# EasyEDA Pro project UCC隔离半桥.eprj

# Schematic Schematic1
Board Name: Board1; Create Date: 2026-04-12; Page Name: P1; Project Name: UCC隔离半桥; Schematic Name: Schematic1; Update Date: 2026-04-18; Company: 嘉立创EDA; Page Size: A4; Version: V1.0
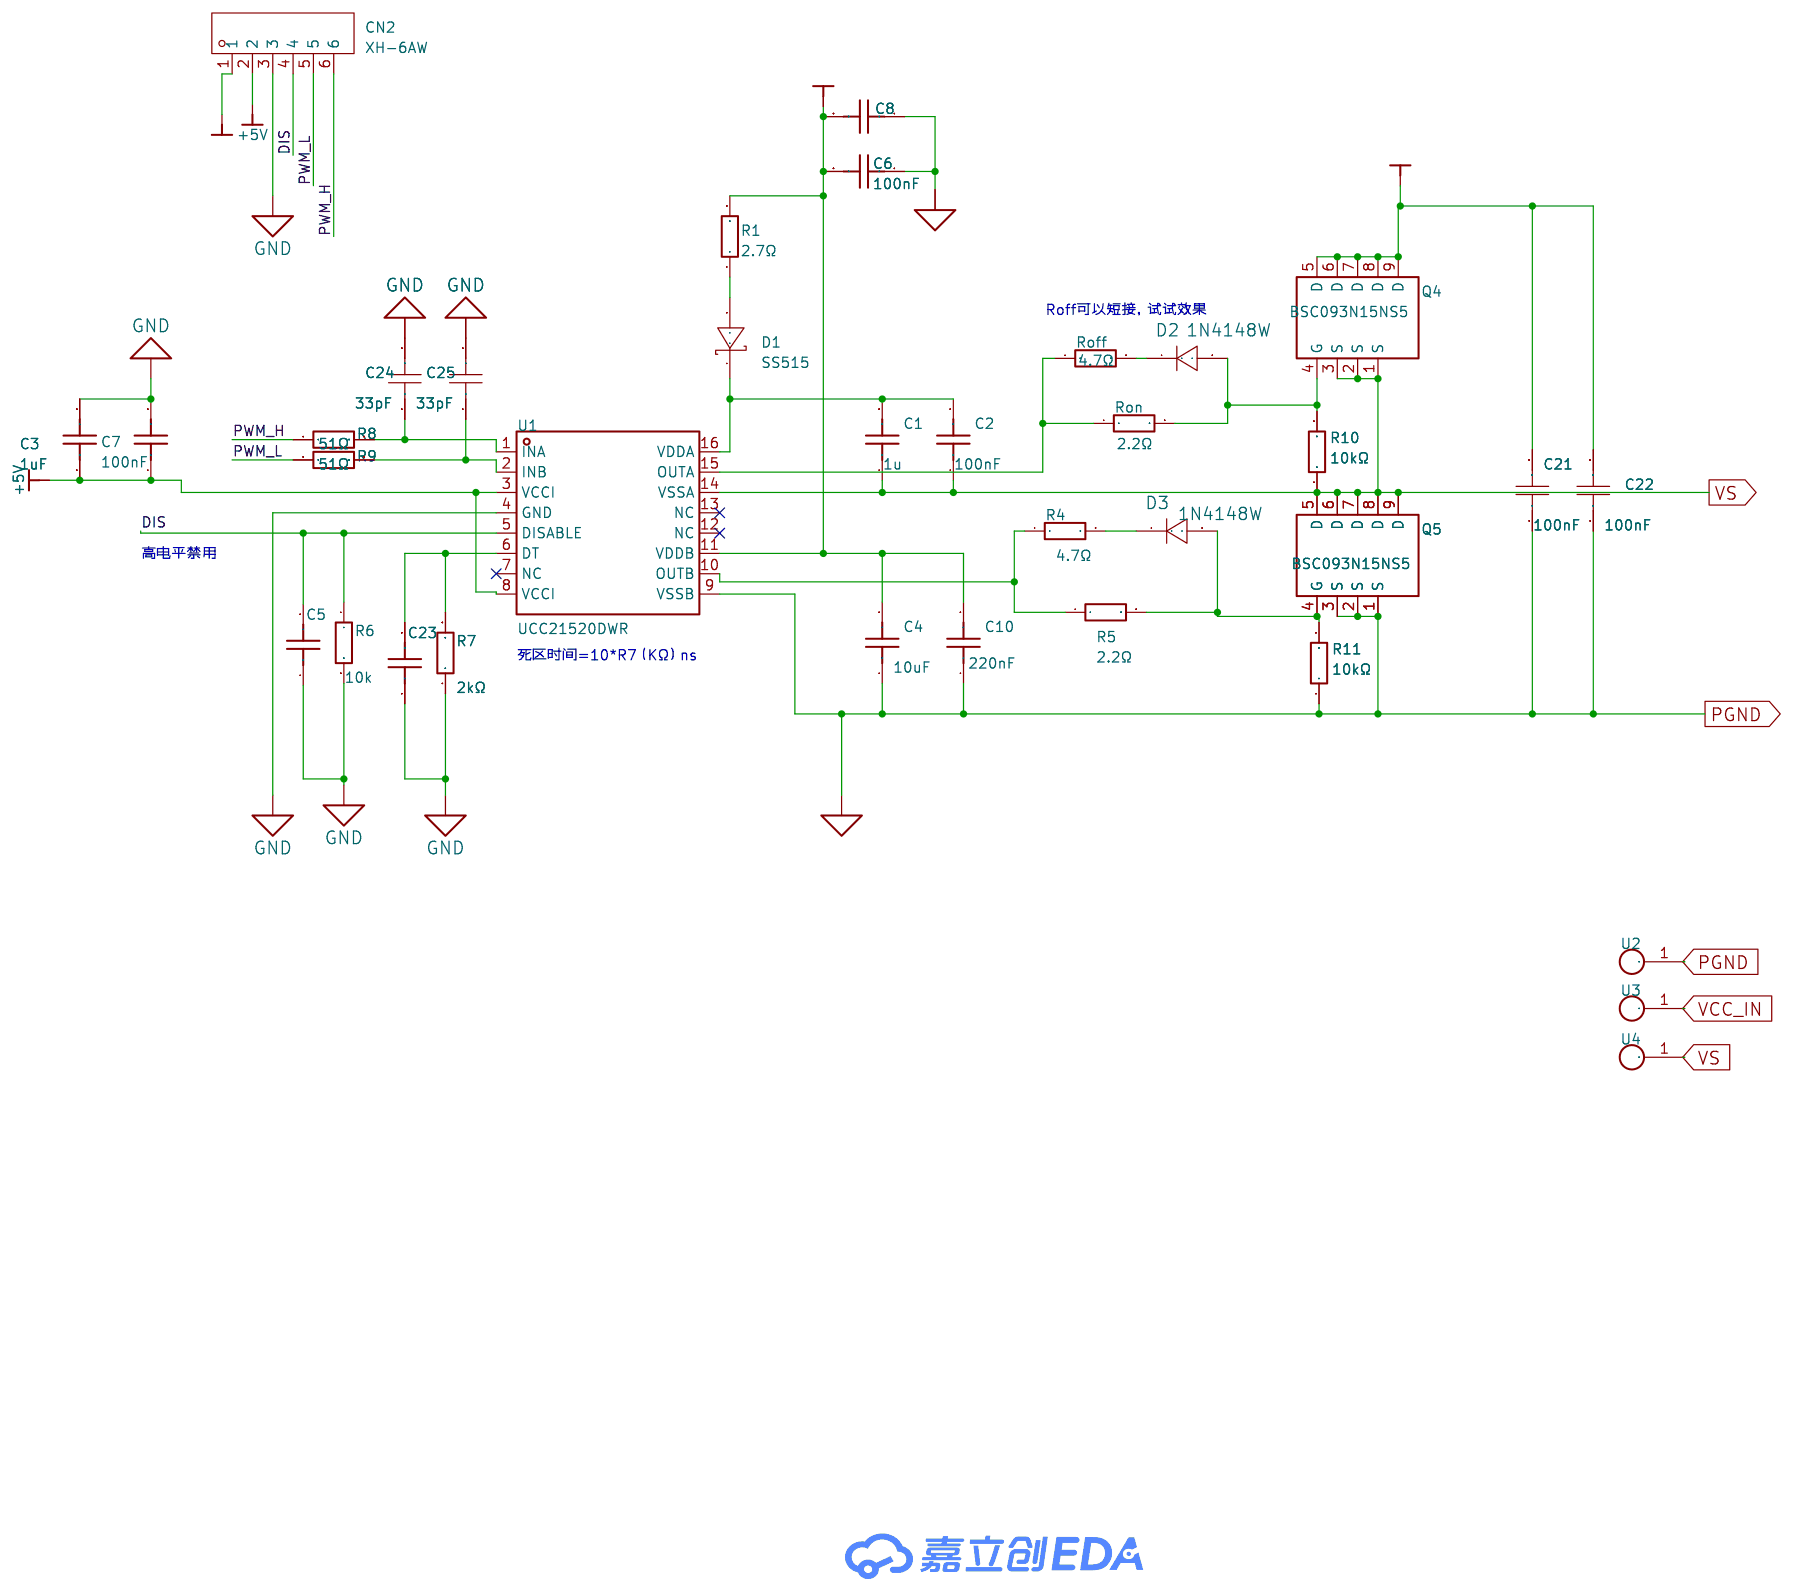
[diagram p0: schematic sheet]

## Parts
C1  1u  [C0603]
C2  100nF  [C0603]
C3  1uF  [C0603]
C4  10uF  [C0603]
C5  1nF  [C0603]
C6  100nF  [C0603]
C7  100nF  [C0603]
C8  10uF  [C0603]
C10  220nF  [C0603]
C21  100nF  [C1206]
C22  100nF  [C1206]
C23  1nF  [C0603]
C24  33pF  [C0603]
C25  33pF  [C0603]
CN2  XH-6AW  [CONN-TH_6P-P2.54_HCTL_XH-6AW_C2908615]
D1  SS515  [SMA_L4.3-W2.6-LS5.2-RD]
D2  1N4148W  [SOD-123_L2.8-W1.8-LS3.7-RD]
D3  1N4148W  [SOD-123_L2.8-W1.8-LS3.7-RD]
Q4  BSC093N15NS5  [PG-TDSON-8_L5.0-W6.0-P1.27-LS6.2-BL-EP]
Q5  BSC093N15NS5  [PG-TDSON-8_L5.0-W6.0-P1.27-LS6.2-BL-EP]
R1  2.7Ω  [R0603]
R4  4.7Ω  [R0603]
R5  2.2Ω  [R0603]
R6  10k  [R0603]
R7  2kΩ  [R0603]
R8  51Ω  [R0603]
R9  51Ω  [R0603]
R10  10kΩ  [R0603]
R11  10kΩ  [R0603]
Roff  4.7Ω  [R0603]
Ron  2.2Ω  [R0603]
U1  UCC21520DWR  [SOIC-16_L10.3-W7.5-P1.27-LS10.3-BL]
U2  -  [3.5mm香蕉头]
U3  -  [3.5mm香蕉头]
U4  -  [3.5mm香蕉头]

## Library data of the parts
C1 C2 = CAP_0805: Supplier Footprint: 0805; Check: false
C3 C10 = CC0603KRX7R9BB104: LCSC Part Name: 100nF ±10% 50V; Supplier Part: C14663; Manufacturer: YAGEO(国巨); Supplier Footprint: 0603; JLCPCB Part Class: Basic Part; Datasheet: https://item.szlcsc.com/datasheet/CC0603KRX7R9BB104/15331.html; Supplier: LCSC; Tolerance: ±10%; Voltage Rating: 50V; Temperature Coefficient: X7R
C4 C7 = CL10A105KB8NNNC: LCSC Part Name: 1uF ±10% 50V; Supplier Part: C15849; Manufacturer: SAMSUNG(三星); Supplier Footprint: 0603; JLCPCB Part Class: Basic Part; Datasheet: https://item.szlcsc.com/datasheet/CL10A105KB8NNNC/16531.html; Supplier: LCSC; Tolerance: ±10%; Voltage Rating: 50V; Temperature Coefficient: X5R
C5 C23 = CL10B102KB8NNNC: LCSC Part Name: 1nF ±10% 50V; Supplier Part: C1588; Manufacturer: SAMSUNG(三星); Supplier Footprint: 0603; JLCPCB Part Class: Basic Part; Datasheet: https://item.szlcsc.com/datasheet/CL10B102KB8NNNC/1940.html; Supplier: LCSC; Tolerance: ±10%; Voltage Rating: 50V; Temperature Coefficient: X7R
C6 = CL10A105KB8NNNC: 容值:1uF;精度:±10%;额定电压:50V;温度系数:X5R;; LCSC Part Name: 1uF ±10% 50V; Supplier Part: C15849; Manufacturer: SAMSUNG(三星); Supplier Footprint: 0603; JLCPCB Part Class: Basic Part; Datasheet: https://item.szlcsc.com/datasheet/CL10A105KB8NNNC/16531.html; Supplier: LCSC; Tolerance: ±10%; Voltage Rating: 50V; Temperature Coefficient: X5R
C8 = CL10A106KP8NNNC: 容值:10uF;精度:±10%;额定电压:10V;温度系数:X5R;; LCSC Part Name: 10uF ±10% 10V; Supplier Part: C19702; Manufacturer: SAMSUNG(三星); Supplier Footprint: 0603; JLCPCB Part Class: Basic Part; Datasheet: https://item.szlcsc.com/datasheet/CL10A106KP8NNNC/20411.html; Supplier: LCSC; Tolerance: ±10%; Voltage Rating: 10V; Temperature Coefficient: X5R
C21 C22 = AM06B475K500NT: 容值:4.7uF;精度:±10%;额定电压:50V;温度系数:X7R;; LCSC Part Name: 4.7uF ±10% 50V; Supplier Part: C47118771; Manufacturer: FH(风华); Supplier Footprint: 1206; JLCPCB Part Class: 扩展库; Datasheet: https://item.szlcsc.com/datasheet/AM06B475K500NT/49314161.html; Supplier: LCSC; Tolerance: ±10%; Voltage Rating: 50V; Temperature Coefficient: X7R
C24 C25 = CC0603JRNPO9BN330: 容值:33pF;精度:±5%;额定电压:50V;材质(温度系数):NP0;; LCSC Part Name: 33pF ±5% 50V; Supplier Part: C107047; Manufacturer: YAGEO(国巨); Supplier Footprint: 0603; JLCPCB Part Class: Extended Part; Datasheet: https://atta.szlcsc.com/upload/public/pdf/source/20170914/C128857_1505359892143968080.pdf; Supplier: LCSC; Tolerance: ±5%; Voltage Rated: 50V; Temperature Coefficient: NP0
CN2 = XH-6AW: 插针结构:1x6P;间距:2.5mm;安装方式:弯插;参考系列:XH;总PIN数:6P;排数:1;每排PIN数:6;行距:-;额定电流:3A;触头材质:黄铜;触头镀层:锡;工作温度:-25℃~+85℃;; LCSC Part Name: 1x6P 间距:2.5mm 弯插 系列:XH; Supplier Part: C2908615; Manufacturer: HCTL(华灿天禄); Supplier Footprint: 弯插,P=2.5mm; JLCPCB Part Class: 扩展库; Datasheet: https://item.szlcsc.com/datasheet/XH-6AW/3184386.html; Supplier: LCSC; Pins Structure: 1x6P; Pitch: 2.5mm; Mounting Type: 弯插; Reference Series: XH; Number of Pins: 6P; Number of Rows: 1; Number of PINs Per Row: 6; Current Rating: 3A; Contact Material: 黄铜; Contact Plating: 锡; Operating Temperature: -25℃~+85℃; Voltage Rating: 250V; Plastic Material: PA66; Flame Retardant Rating: UL94V-0; Z-Height of the Board: 5.9mm; Y-Width of Bottom Edge on Board: 7mm
D1 = SS510_C65010: 100V,5A,VF=0.85V@5A; LCSC Part Name: SS510; Supplier Part: C65010; Manufacturer: MDD; Supplier Footprint: SMA(DO-214AC); JLCPCB Part Class: 扩展库; Datasheet: https://atta.szlcsc.com/upload/public/pdf/source/20190306/C65010_D958AD6D6141949533CEFECD76698368.pdf; Supplier: LCSC
D2 D3 = 1N4148W_C2099: 二极管配置:独立式;正向压降(Vf):1.25V@150mA;直流反向耐压(Vr):100V;平均整流电流(Io):150mA;反向恢复时间(trr):4ns;; LCSC Part Name: 电压:100V 电流:150mA; Supplier Part: C2099; Manufacturer: CJ(江苏长电/长晶); Supplier Footprint: SOD-123; JLCPCB Part Class: Extended Part; Datasheet: https://atta.szlcsc.com/upload/public/pdf/source/20120428/1457706480199.pdf; Supplier: LCSC; Diode Configuration: 独立式; Forward Voltage (Vf@If): 1.25V@150mA; Reverse Voltage (Vr): 100V; Average Rectified Current (Io): 150mA; Reverse Leakage Current: 1uA@75V; Reverse Recovery Time (trr): 4ns
Q4 Q5 = BSC093N15NS5: LCSC Part Name: 1个N沟道 耐压:150V 电流:87A; Supplier Part: C454270; Manufacturer: Infineon(英飞凌); Supplier Footprint: TDSON-8(5x6); JLCPCB Part Class: 扩展库; Datasheet: https://item.szlcsc.com/datasheet/BSC093N15NS5/456361.html; Supplier: LCSC; Number: 1个N沟道; Drain to Source Voltage: 150V; Current - Continuous Drain(Id): 87A; RDS(on): 9.3mΩ@10V,44A; Pd - Power Dissipation: 139W; Gate Threshold Voltage (Vgs(th)): 4.6V; Gate Charge(Qg): 40.7nC@10V; Input Capacitance(Ciss): 3.23nF@75V; Reverse Transfer Capacitance (Crss@Vds): 26pF@75V; Operating Temperature: -55℃~+150℃
R1 = RC0805FR-072R2L: LCSC Part Name: 厚膜电阻 2.2Ω ±1% 125mW; Supplier Part: C137549; Manufacturer: YAGEO(国巨); Supplier Footprint: 0805; JLCPCB Part Class: Extended Part; Datasheet: https://atta.szlcsc.com/upload/public/pdf/source/20180821/C275644_0D56F95EFF785E7D9A1FEF436B37DA78.pdf; Supplier: LCSC; Type: 厚膜电阻; Tolerance: ±1%; Power(Watts): 125mW; Overload Voltage (Max): 150V; Temperature Coefficient: ±200ppm/℃; Operating Temperature Range: -55℃~+155℃
R4 R5 Roff Ron = Res_1206: Supplier Footprint: 1206
R6 R7 = RC0603FR-0710KL: LCSC Part Name: 厚膜电阻 10kΩ ±1% 100mW; Supplier Part: C98220; Manufacturer: YAGEO(国巨); Supplier Footprint: 0603; JLCPCB Part Class: Extended Part; Datasheet: https://atta.szlcsc.com/upload/public/pdf/source/20180927/C295883_E8D83085EA81BD7DE0B2B681138C15EE.pdf; Supplier: LCSC; Type: 厚膜电阻; Tolerance: ±1%; Power(Watts): 100mW; Overload Voltage (Max): 75V; Temperature Coefficient: ±100ppm/℃; Operating Temperature Range: -55℃~+155℃
R8 R9 = 0603WAF510JT5E: LCSC Part Name: 51Ω ±1% 100mW 厚膜电阻; Supplier Part: C23197; Manufacturer: UNI-ROYAL(厚声); Supplier Footprint: 0603; JLCPCB Part Class: Basic Part; Datasheet: https://item.szlcsc.com/datasheet/0603WAF510JT5E/23924.html; Supplier: LCSC; Type: 厚膜电阻; Tolerance: ±1%; Power(Watts): 100mW; Voltage-Supply(Max): 75V; Temperature Coefficient: ±100ppm/℃; Operating Temperature: -55℃~+155℃
R10 R11 = 0603WAF1002T5E: LCSC Part Name: 厚膜电阻 10kΩ ±1% 100mW; Supplier Part: C25804; Manufacturer: UNI-ROYAL(厚声); Supplier Footprint: 0603; JLCPCB Part Class: Basic Part; Datasheet: https://item.szlcsc.com/datasheet/0603WAF1002T5E/26547.html; Supplier: LCSC; Type: 厚膜电阻; Tolerance: ±1%; Power(Watts): 100mW; Voltage-Supply(Max): 75V; Temperature Coefficient: ±100ppm/℃; Operating Temperature: -55℃~+155℃
U1 = UCC21520DWR: Supplier Part: C601651; Manufacturer: TI(德州仪器); Supplier Footprint: SOIC-16; JLCPCB Part Class: Extended Part; Supplier: LCSC; NO_CONNECT: yes
U2-U4 = 3.5mm香蕉头

## Nets
+5V: C3.1 C7.1 CN2.2 U1.3(VCCI) U1.8(VCCI)
+12V: C4.2 C6.2 C8.2 C10.2 CN2.1 R1.2 U1.11(VDDB)
GND: C3.2 C5.1 C7.2 C23.1 C24.2 C25.2 CN2.3 R6.2 R7.1 U1.4(GND)
PGND: C4.1 C6.1 C8.1 C10.1 C21.1 C22.1 Q5.1(S) Q5.2(S) Q5.3(S) R11.1 U1.9(VSSB) U2.1
VCC_IN: C21.2 C22.2 Q4.5(D) Q4.6(D) Q4.7(D) Q4.8(D) Q4.9(D) U3.1
DIS: C5.2 CN2.4 R6.1 U1.5(DISABLE)
PWM_H: CN2.6 R8.1
PWM_L: CN2.5 R9.1
VS: C1.1 C2.1 Q4.1(S) Q4.2(S) Q4.3(S) Q5.5(D) Q5.6(D) Q5.7(D) Q5.8(D) Q5.9(D) R10.1 U1.14(VSSA) U4.1
$1N1256: Roff.1 Ron.1 U1.15(OUTA)
$1N1258: C1.2 C2.2 D1.1(K) U1.16(VDDA)
$1N1260: D2.2(A) Q4.4(G) R10.2 Ron.2
$1N1264: D3.1(K) R4.2
$1N1267: C23.2 R7.2 U1.6(DT)
$1N1268: C24.1 R8.2 U1.1(INA)
$1N1269: C25.1 R9.2 U1.2(INB)
$1N2967: D1.2(A) R1.1
$1N3349: D2.1(K) Roff.2
$1N5239: D3.2(A) Q5.4(G) R5.2 R11.2
$1N5400: R4.1 R5.1 U1.10(OUTB)

Not connected (* = marked no-connect by the designer): U1 7(NC)* 12(NC)* 13(NC)*

## Notes on the sheet
- Roff可以短接，试试效果
- 高电平禁用
- 死区时间=10*R7（KΩ）ns

# Board PCB1
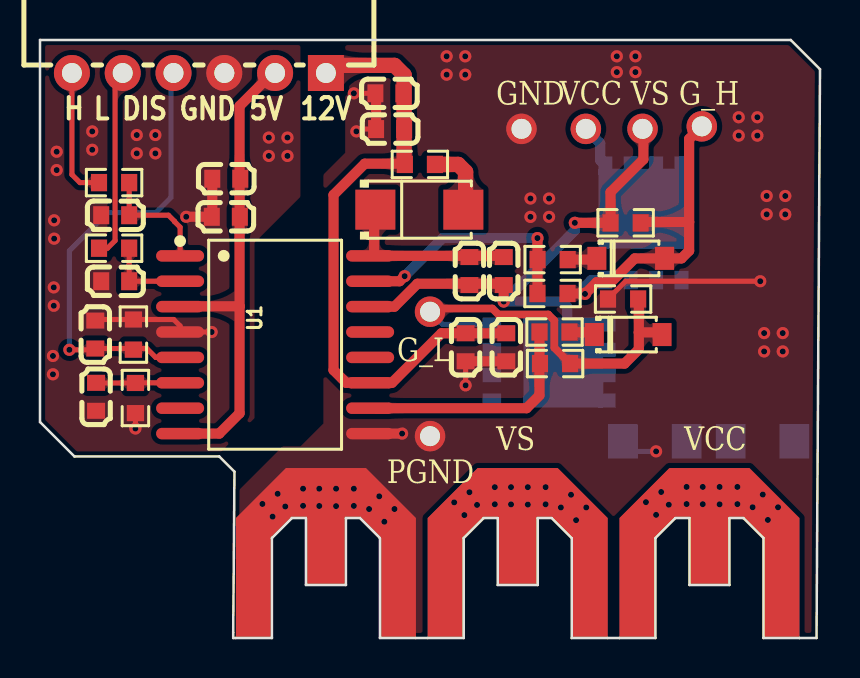
[diagram p1: board, top side]
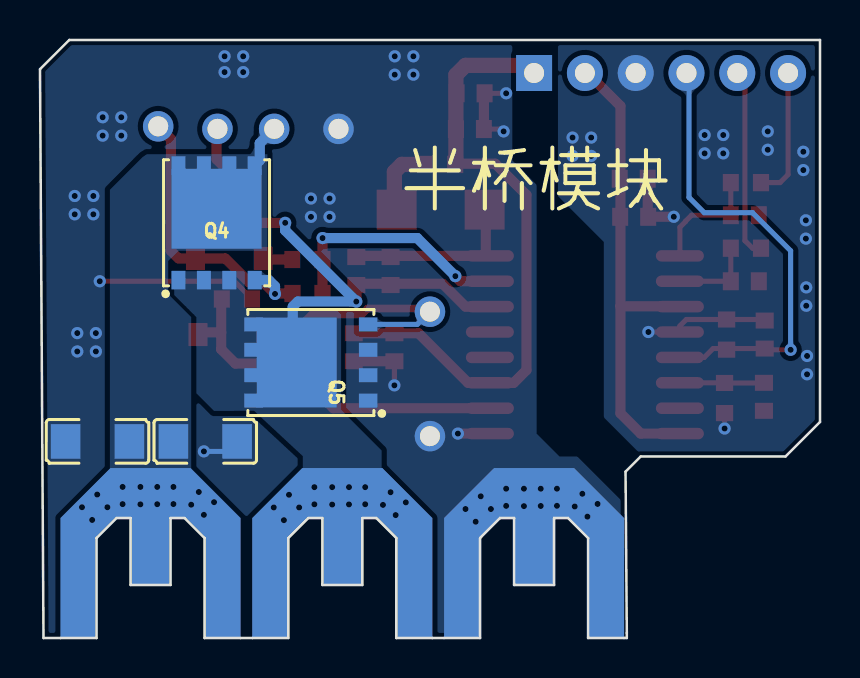
[diagram p2: board, bottom side, seen from below]

Outline 39 x 29.91 mm; copper layers: Top Layer, Bottom Layer. Coordinates in mm from the lower left corner of the outline.
Outline path: 9.8,0 9.66,0 9.66,0.26 9.72,8.32 8.96,9.08 1.72,9.08 0,10.8 0,29.91 37.54,29.91 39,28.44 38.83,0 37.97,0 ; 18.8,0 19.38,0 ; 28.38,0 28.97,0
Stack: Top Layer 0.035mm / Dielectric1 1.51mm FR4 er 4.5 / Bottom Layer 0.035mm

## Design rules (mm)
template: 自定义配置
spacing copperThickness1oz (default): track to track 0.102, other pairs 0.152 to 0.3
spacing copperThickness2oz: track to track 0.203, other pairs 0.152 to 0.3
track width copperThickness1oz (default): min 0.127, default 0.254, max 2.54
track width copperThickness2oz: min 0.203, default 0.254, max 2.54
differential pair differentialPair (default): width min 0.127, default 0.254, max 2.54; gap min 0.152, default 0.152
via viaSize (default): diameter min 0.5, default 0.61, max 10; hole min 0.3, default 0.305, max 6.3

## Placement (name value [footprint] x y rotation side)
C1  1u  [C0603]  21.47 18.35 90 top
C2  100nF  [C0603]  23.19 18.35 90 top
C3  1uF  [C0603]  9.29 21.07 180 top
C4  10uF  [C0603]  21.28 14.54 90 top
C5  1nF  [C0603]  2.77 15.18 270 top
C6  100nF  [C0603]  17.51 25.45 0 top
C7  100nF  [C0603]  9.31 22.97 180 top
C8  10uF  [C0603]  17.47 27.24 0 top
C10  220nF  [C0603]  23.31 14.54 90 top
C21  100nF  [C1206]  36.13 9.83 180 bottom
C22  100nF  [C1206]  30.74 9.83 0 bottom
C23  1nF  [C0603]  2.8 12.06 90 top
C24  33pF  [C0603]  3.76 21.15 180 top
C25  33pF  [C0603]  3.76 17.84 180 top
CN2  XH-6AW  [CONN-TH_6P-P2.54_HCTL_XH-6AW_C2908615]  7.95 28.26 180 top
D1  SS515  [SMA_L4.3-W2.6-LS5.2-RD]  18.97 21.42 0 top
D2  1N4148W  [SOD-123_L2.8-W1.8-LS3.7-RD]  29.54 18.99 0 top
D3  1N4148W  [SOD-123_L2.8-W1.8-LS3.7-RD]  29.41 15.18 0 top
NOREF  -  [Pad_e163]  19.5 10.1 0 top
NOREF#2  -  [Pad_e164]  33.09 25.59 0 top
NOREF#3  -  [Pad_e50]  24.07 25.46 0 top
NOREF#4  -  [Pad_e127]  27.29 25.46 0 top
NOREF#5  -  [Pad_e49]  30.13 25.46 0 top
NOREF#6  -  [Pad_e162]  19.5 16.32 0 top
Q4  BSC093N15NS5  [PG-TDSON-8_L5.0-W6.0-P1.27-LS6.2-BL-EP]  30.17 20.76 180 bottom
Q5  BSC093N15NS5  [PG-TDSON-8_L5.0-W6.0-P1.27-LS6.2-BL-EP]  25.46 13.78 90 bottom
R1  2.7Ω  [R0603]  18.99 23.69 180 top
R4  4.7Ω  [R0603]  25.73 15.3 0 top
R5  2.2Ω  [R0603]  25.75 13.73 0 top
R6  10k  [R0603]  4.67 15.18 90 top
R7  2kΩ  [R0603]  4.77 12 90 top
R8  51Ω  [R0603]  3.7 22.78 0 top
R9  51Ω  [R0603]  3.7 19.49 0 top
R10  10kΩ  [R0603]  29.28 20.76 0 top
R11  10kΩ  [R0603]  29.16 16.95 0 top
Roff  4.7Ω  [R0603]  25.63 18.93 0 top
Ron  2.2Ω  [R0603]  25.63 17.23 0 top
U1  UCC21520DWR  [SOIC-16_L10.3-W7.5-P1.27-LS10.3-BL]  11.76 14.67 270 top
U2  -  [3.5mm香蕉头]  14.3 4 0 top
U3  -  [3.5mm香蕉头]  33.47 4 0 top
U4  -  [3.5mm香蕉头]  23.88 4 0 top

## Footprints (pads in the part's own frame, mm; a bottom-side part is the same pattern mirrored in y, then rotated)
3.5mm香蕉头
  custom 9x8.5 smd: 1(0,1.585)
  custom 9x8.5 smd far side: 1(0,1.585)
C0603
  rect 0.8x0.9 smd: 1(-0.7,0) 2(0.7,0)
C1206
  rect 1.485x1.728 smd: 1(-1.593,0) 2(1.593,0)
CONN-TH_6P-P2.54_HCTL_XH-6AW_C2908615
  rect 1.8x1.8 hole 1: 1(-6.35,0)
  round 1.8 hole 1: 2(-3.81,0) 3(-1.27,0) 4(1.27,0) 5(3.81,0) 6(6.35,0)
Pad_e49
  round 1.524 hole 1: 1(0,0)
Pad_e50
  round 1.524 hole 1: 1(0,0)
Pad_e127
  round 1.524 hole 1: 1(0,0)
Pad_e162
  round 1.524 hole 1: 1(0,0)
Pad_e163
  round 1.524 hole 1: 1(0,0)
Pad_e164
  round 1.524 hole 1: 1(0,0)
PG-TDSON-8_L5.0-W6.0-P1.27-LS6.2-BL-EP
  rect 0.7x0.925 smd: 1(-1.905,-2.865) 2(-0.635,-2.865) 3(0.635,-2.865) 4(1.905,-2.865) 5(1.905,2.865) 6(0.635,2.865) 7(-0.635,2.865) 8(-1.905,2.865)
  rect 4.5x4 smd: 9(0.001,0.705)
R0603
  rect 0.806x0.864 smd: 1(-0.753,0) 2(0.753,0)
SMA_L4.3-W2.6-LS5.2-RD
  rect 2x2 smd: 1(-2.2,0) 2(2.2,0)
SOD-123_L2.8-W1.8-LS3.7-RD
  rect 0.95x1.15 smd: 1(-1.692,0) 2(1.692,0)
SOIC-16_L10.3-W7.5-P1.27-LS10.3-BL
  oval 0.574x2.401 smd: 1(-4.445,-4.75) 2(-3.175,-4.75) 3(-1.905,-4.75) 4(-0.635,-4.75) 5(0.635,-4.75) 6(1.905,-4.75) 7(3.175,-4.75) 8(4.445,-4.75) 9(4.445,4.75) 10(3.175,4.75) 11(1.905,4.75) 12(0.635,4.75) 13(-0.635,4.75) 14(-1.905,4.75) 15(-3.175,4.75) 16(-4.445,4.75)

## Nets
+5V: C3.1 C7.1 CN2.2 U1.3 U1.8
+12V: C4.2 C6.2 C8.2 C10.2 CN2.1 R1.2 U1.11
GND: C3.2 C5.1 C7.2 C23.1 C24.2 C25.2 CN2.3 R6.2 R7.1 U1.4
PGND: C4.1 C6.1 C8.1 C10.1 C21.1 C22.1 NOREF.1 NOREF#3.1 Q5.1 Q5.2 Q5.3 R11.1 U1.9 U2.1
VCC_IN: C21.2 C22.2 NOREF#4.1 Q4.5 Q4.6 Q4.7 Q4.8 Q4.9 U3.1
DIS: C5.2 CN2.4 R6.1 U1.5
PWM_H: CN2.6 R8.1
PWM_L: CN2.5 R9.1
VS: C1.1 C2.1 NOREF#5.1 Q4.1 Q4.2 Q4.3 Q5.5 Q5.6 Q5.7 Q5.8 Q5.9 R10.1 U1.14 U4.1
$1N1256: Roff.1 Ron.1 U1.15
$1N1258: C1.2 C2.2 D1.1 U1.16
$1N1260: D2.2 NOREF#2.1 Q4.4 R10.2 Ron.2
$1N1264: D3.1 R4.2
$1N1267: C23.2 R7.2 U1.6
$1N1268: C24.1 R8.2 U1.1
$1N1269: C25.1 R9.2 U1.2
$1N2967: D1.2 R1.1
$1N3349: D2.1 Roff.2
$1N5239: D3.2 NOREF#6.1 Q5.4 R5.2 R11.2
$1N5400: R4.1 R5.1 U1.10

Pads without a net: U1 7 12 13

## Via types
v1: diameter 0.61, hole 0.305, Top Layer to Bottom Layer, 105 vias

## Routing (per net, layer and track width the routed paths; a pad name or vN(x,y) marks a point on that pad's centre or on a via; arc(x,y) is an arc through that point)
+5V: length 24.2
  Top Layer w0.508: U1.8 8.96,10.22 9.98,11.24 9.98,16.59 ; U1.3 7.02,16.59 9.98,16.59 ; CN2.2 11.63,28.26 9.98,26.61 9.98,16.59
+12V: length 31.6
  Top Layer w0.508: C10.2 C4.2 20.08,15.24 17.6,12.76 U1.11 15.31,12.76 14.68,13.4 14.68,22.16 16.24,23.72 18.21,23.72
  Top Layer w0.762: R1.2 18.21,23.72 C6.2 18.21,28.16 17.72,28.64 14.17,28.64
GND: length 10.2
  Top Layer w0.254: v1(8.58,15.3) U1.4 7.01,15.61 6.68,15.93 R6.2 2.82,15.93 C5.1 ; R7.1 v1(4.77,10.48)
  Top Layer w0.508: C7.2 8.61,21.09 C3.2 v1(7.31,21.07)
  vias: v1(0.71,20.89) v1(0.71,19.97) v1(0.69,17.54) v1(0.69,16.62) v1(0.65,14.11) v1(0.65,13.19) v1(0.83,24.32) v1(0.83,23.4) v1(2.61,25.34) v1(2.61,24.42) v1(4.84,25.16) v1(4.84,24.24) v1(5.77,25.16) v1(5.77,24.24) v1(11.44,25.03) v1(11.44,24.11) v1(12.37,25.03) v1(12.37,24.11)
PGND: length 18.7
  Top Layer w0.254: C6.1 15.94,25.45 v1(15.82,25.34) ; v1(36.01,17.84) 29.28,17.84 28.4,16.96 28.4,16.83 ; C8.1 v1(15.69,27.24) ; C4.1 v1(21.28,12.64)
  Top Layer w0.508: C6.1 16.81,27.21 C8.1 ; C10.1 C4.1 ; U1.9 v1(18.11,10.22)
  Bottom Layer w0.254: C22.1 29.65,9.33 v1(30.81,9.33)
  vias: v1(11.12,6.71) v1(11.63,6.07) v1(11.88,7.21) v1(12.26,6.58) v1(13.15,7.47) v1(13.15,6.61) v1(13.96,7.47) v1(13.96,6.6) v1(14.8,7.47) v1(14.8,6.6) v1(15.69,7.47) v1(15.69,6.61) v1(16.45,6.45) v1(16.96,7.09) v1(17.22,5.82) v1(17.72,6.45) v1(20.33,29.09) v1(20.33,28.17) v1(21.26,29.09) v1(21.26,28.17) v1(24.52,21.98) v1(24.52,21.06) v1(25.45,21.98) v1(25.45,21.06) v1(28.84,29.09) v1(28.84,28.3) v1(29.77,29.09) v1(29.77,28.3) v1(34.94,26.04) v1(34.94,25.13) v1(35.87,26.04) v1(35.87,25.13) v1(36.21,15.25) v1(36.21,14.33) v1(36.33,22.11) v1(36.33,21.19) v1(37.14,15.25) v1(37.14,14.33) v1(37.26,22.11) v1(37.26,21.19)
VCC_IN: length 2.2
  Bottom Layer w0.508: Q4.5 28.01,23.88 28.01,24.74 NOREF#4.1
  vias: v1(30.3,6.79) v1(30.81,6.16) v1(31.06,7.3) v1(31.44,6.67) v1(32.33,7.56) v1(32.33,6.7) v1(33.14,7.56) v1(33.14,6.69) v1(33.98,7.56) v1(33.98,6.69) v1(34.87,7.56) v1(34.87,6.7) v1(35.63,6.54) v1(36.14,7.18) v1(36.39,5.91) v1(36.9,6.54)
DIS: length 23.5
  Top Layer w0.254: U1.5 5.79,14.03 5.34,14.48 C5.2 2.7,14.41 v1(1.47,14.41)
  Bottom Layer w0.254: v1(1.47,14.41) 1.47,19.37 3.37,21.27 5.79,21.27 6.55,22.03 6.55,28.64
PWM_H: length 6.6
  Top Layer w0.254: R8.1 2,22.78 1.6,23.18 CN2.6
PWM_L: length 9.5
  Top Layer w0.254: R9.1 3.37,19.49 3.75,19.88 3.75,27.88 CN2.5
VS: length 26.8
  Top Layer w0.508: 23.19,17.52 22.99,17.72 18.87,17.72 17.72,16.57 U1.14 ; 23.19,17.52 v1(23.19,16.83) ; 23.19,17.52 C2.1 ; v1(26.74,20.76) R10.1 28.53,22.3 30.17,23.94 30.17,25.46
  Bottom Layer w0.508: v1(26.74,20.76) 26.74,20.38 v1(23.19,16.83) 26.11,16.83 26.36,16.57 26.36,13.98 Q5.9
  vias: v1(20.71,6.78) v1(21.22,6.15) v1(21.47,7.29) v1(21.85,6.66) v1(22.74,7.55) v1(22.74,6.69) v1(23.55,7.55) v1(23.55,6.68) v1(24.39,7.55) v1(24.39,6.67) v1(25.28,7.55) v1(25.28,6.69) v1(26.04,6.53) v1(26.55,7.16) v1(26.81,5.89) v1(27.31,6.53)
$1N1256: length 12
  Top Layer w0.508: v1(18.23,18.1) 17.98,17.84 U1.15 ; Ron.1 v1(24.87,20)
  Bottom Layer w0.508: v1(18.23,18.1) 20.14,20 v1(24.87,20)
$1N1258: length 8.8
  Top Layer w0.508: 23.19,18.92 23,19.11 16.71,19.11 16.71,21.14 16.59,21.26
$1N1260: length 17.4
  Top Layer w0.508: NOREF#2.1 32.46,24.96 32.46,20.8 ; Ron.2 27.23,17.23 v1(27.25,17.21) 27.25,17.21 27.83,17.79 28.55,17.79 29.74,18.99 D2.2 32.08,18.99 32.46,19.37 32.46,20.8 ; R10.2 30.08,20.8 32.46,20.8
  Bottom Layer w0.508: 28.22,17.9 27.56,17.9 27.25,17.59 v1(27.25,17.21)
$1N1264: length 1.2
  Top Layer w0.508: R4.2 26.49,15.29 27.66,15.29
$1N1267: length 4.2
  Top Layer w0.254: U1.6 4.78,12.76 R7.2 2.81,12.75 C23.2
$1N1268: length 5.9
  Top Layer w0.254: R8.2 4.46,22.77 C24.1 6.42,21.15 6.73,20.84 6.73,20.82 7.01,20.55 U1.1
$1N1269: length 4.2
  Top Layer w0.254: U1.2 C25.1 4.46,19.49 R9.2
$1N2967: length 3.8
  Top Layer w0.762: 21.4,21.28 21.28,21.4 21.28,23.31 20.91,23.69 R1.1
$1N3349: length 1.4
  Top Layer w0.508: Roff.2 27.75,18.93
$1N5239: length 19.7
  Top Layer w0.381: R5.2 25.72,14.51 25.72,15.88 25.42,16.18 22.92,16.18 22.62,16.48 19.66,16.48
  Top Layer w0.508: R5.2 29.23,13.73 29.94,14.44 29.94,15.29 ; 29.94,15.29 30.99,15.29 D3.2 ; 29.94,15.29 29.94,16.79 29.91,16.83 ; NOREF#6.1 19.66,16.48
  Bottom Layer w0.254: NOREF#6.1 20.14,15.68 Q5.4
$1N5400: length 11.6
  Top Layer w0.508: 16.76,11.49 24.33,11.49 24.97,12.14 R4.1

## Copper pours and planes (outline as drawn; the poured copper is in the pictures)
GND on Top Layer: 10.73,10.99 7.42,7.68 -0.69,7.68 -1.33,8.32 -1.33,29.4 0.58,31.31 11.76,31.31 13.03,30.04 13.03,22.06 10.73,19.77
GND on Bottom Layer: 10.81,11.03 7.5,7.72 -0.61,7.72 -1.25,8.36 -1.25,29.44 0.66,31.34 11.83,31.34 13.1,30.07 13.1,22.1 10.81,19.81
PGND on Top Layer: 15.26,33.09 15.26,24.27 14.17,23.18 14.17,10.73 13.03,9.59 12.14,9.59 8.96,6.41 8.96,-0.57 9.6,-1.21 39.57,-1.21 40.97,0.19 40.97,30.8 39.44,32.32 16.03,32.32
PGND on Bottom Layer: 16.2,15.02 23.31,15.02 23.31,5.91 16.2,5.91
PGND on Bottom Layer: 15.39,32.46 15.39,23.89 14.17,22.67 14.17,10.22 13.03,9.08 12.14,9.08 8.96,5.91 8.96,-1.08 9.6,-1.71 39.57,-1.71 40.97,-0.32 40.97,30.29 39.44,31.81 16.03,31.81
VCC_IN on Bottom Layer: 27.63,24.19 35.5,24.19 35.5,7.94 27.63,7.94
VS on Bottom Layer: 21.92,18.34 32.29,18.34 32.29,7.67 21.92,7.67

Small or netless copper shapes (teardrops, artwork), in the pictures only: 104 on Top Layer, 14 on Bottom Layer

## Text on the board
Bottom Silkscreen Layer: 半桥模块
Top Silkscreen Layer: H | L | DIS | GND | 5V | 12V | PGND | G_L | VS | VCC | G_H
